# Altium schematic sheet ChargerIC.SchDoc
size A4; SheetNumber: 2; SheetTotal: 4
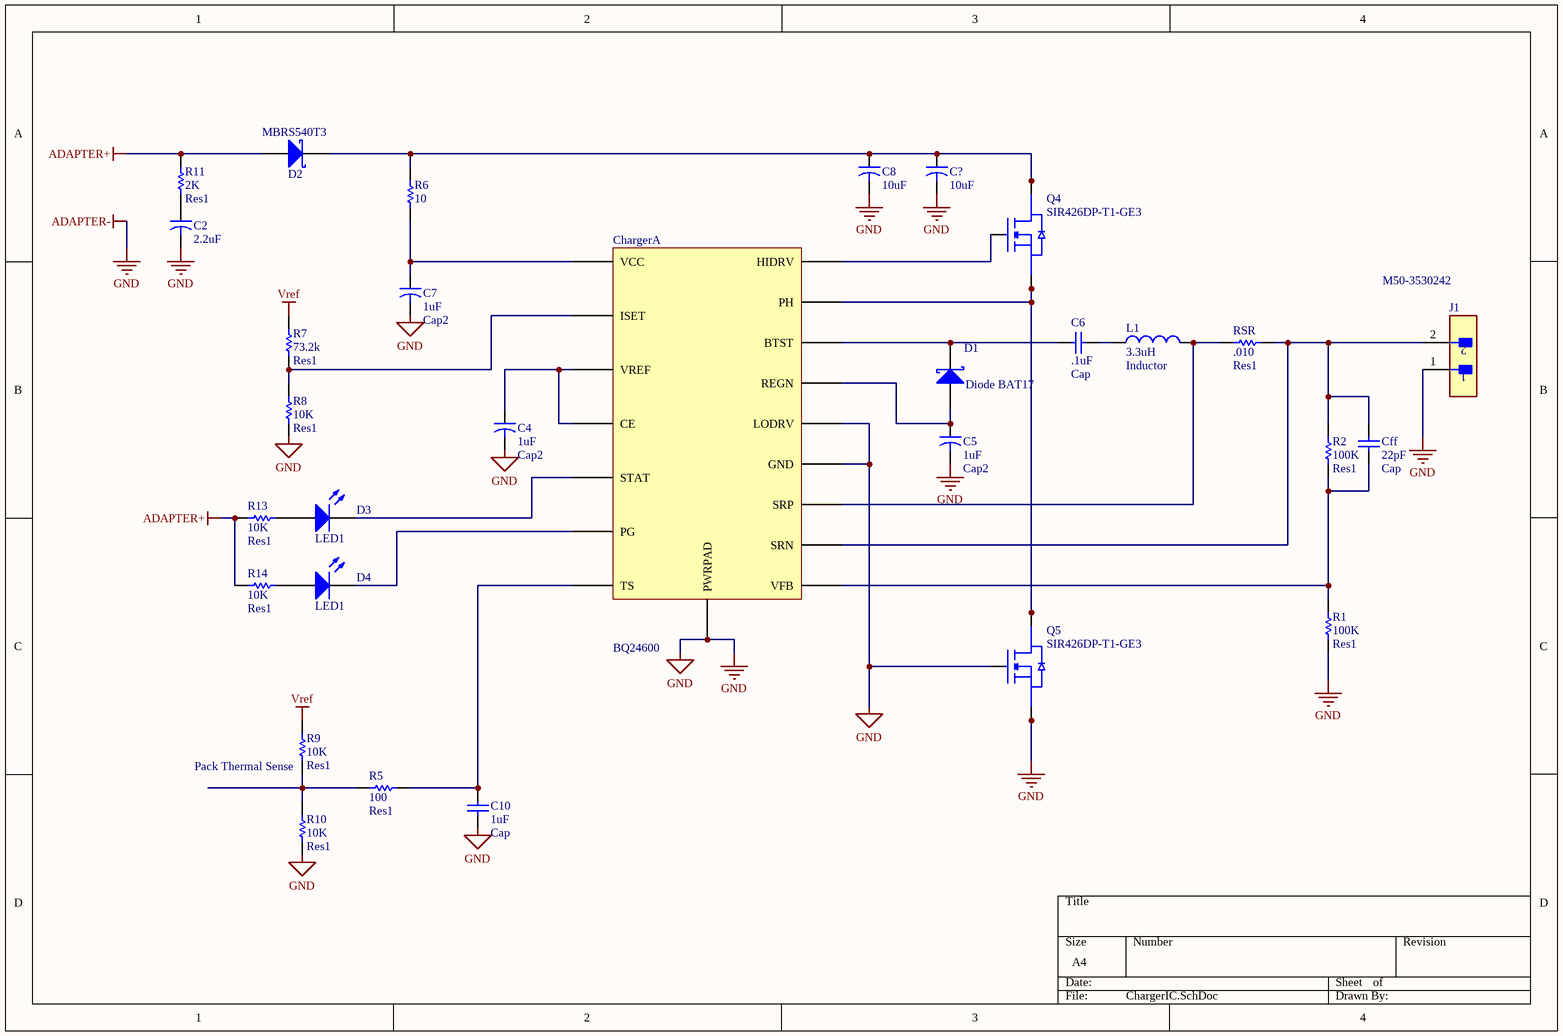
[diagram p0: ChargerIC.SchDoc]

## Parts
C2  value 2.2uF  [CAPR5-4X5]  (hidden comment: Cap2)
C4  Cap2  value 1uF  [CAPR5-4X5]
C5  Cap2  value 1uF  [CAPR5-4X5]
C6  Cap  value .1uF  [RAD-0.3]
C7  Cap2  value 1uF  [CAPR5-4X5]
C8  value 10uF  [CAPR5-4X5]  (hidden comment: Cap2)
C10  Cap  value 1uF  [RAD-0.3]
C?  value 10uF  [CAPR5-4X5]  (hidden comment: Cap2)
Cff  Cap  value 22pF  [RAD-0.3]
Charger  BQ24600  (part A of 2)
D1  Diode BAT17  [SOT-23_N]
D3  LED1  [LED-1]
D4  LED1  [LED-1]
J1  M50-3530242  [FP-M50-3530242-MFG]
L1  Inductor  L1: 3.3uH  [0402-A]
MBRS540T3  D2  [SMB]
Q4  SIR426DP-T1-GE3  [TRANS_SIRA90DP-T1-GE3]
Q5  SIR426DP-T1-GE3  [TRANS_SIRA90DP-T1-GE3]
R1  Res1  value 100K  [AXIAL-0.3]
R2  Res1  value 100K  [AXIAL-0.3]
R5  Res1  value 100  [AXIAL-0.3]
R6  value 10  [AXIAL-0.3]  (hidden comment: 10Ohm)
R7  Res1  value 73.2k  [AXIAL-0.3]
R8  Res1  value 10K  [AXIAL-0.3]
R9  Res1  value 10K  [AXIAL-0.3]
R10  Res1  value 10K  [AXIAL-0.3]
R11  Res1  value 2K  [AXIAL-0.3]
R13  Res1  value 10K  [AXIAL-0.3]
R14  Res1  value 10K  [AXIAL-0.3]
RSR  Res1  value .010  [AXIAL-0.3]

## Nets
ADAPTER+: MBRS540T3.1(A) R11.1 R13.1 R14.1
ADAPTER-: C2.2 C4.2 C5.2 C7.2 C8.2 C10.1 C?.2 Charger.31(LODRV) Charger.32(GND) Charger.36(PWRPAD) J1.1 Q5.1(S) Q5.2(S) Q5.3(S) Q5.4(G) R1.1 R8.1 R10.2  [also labelled GND]
Vref: R7.2 R9.1
NetC2_1: C2.1 R11.2
NetC4_1: C4.1 Charger.17(VREF) Charger.18(CE)
NetC5_1: C5.1 Charger.30(REGN) D1.1(A)
NetC6_1: C6.1 Charger.28(BTST) D1.3(K)
NetC6_2: C6.2 L1.1
NetC7_1: C7.1 Charger.15(VCC) R6.2
NetC8_1: C8.1 C?.1 MBRS540T3.2(K) Q4.5(D) Q4.6(D) Q4.7(D) Q4.8(D) Q4.9(D) R6.1
NetC10_2: C10.2 Charger.29(TS) R5.2
NetCff_1: Cff.1 Charger.35(VFB) R1.2 R2.1
NetCff_2: Cff.2 Charger.34(SRN) J1.2 R2.2 RSR.2
NetCharger_16: Charger.16(ISET) R7.1 R8.2
NetCharger_19: Charger.19(STAT) D3.2(K)
NetCharger_20: Charger.20(PG) D4.2(K)
NetCharger_26: Charger.26(HIDRV) Q4.4(G)
NetCharger_27: Charger.27(PH) Q4.1(S) Q4.2(S) Q4.3(S) Q5.5(D) Q5.6(D) Q5.7(D) Q5.8(D) Q5.9(D)
NetCharger_33: Charger.33(SRP) L1.2 RSR.1
NetD3_1: D3.1(A) R13.2
NetD4_1: D4.1(A) R14.2
NetR5_1: R5.1 R9.2 R10.1

## Notes on the sheet
- (near R9) Pack Thermal Sense

## Library data of the parts
C2 C4 C5 C7 C8 C? = Cap2: Capacitor; Published: 23-Sep-2002; PackageReference: CAPR5-4X5; Publisher: Altium Limited; PackageDescription: Capacitor; 2 Leads
C6 C10 Cff = Cap: Capacitor; Published: 8-Jun-2000; LatestRevisionDate: 17-Jul-2002; LatestRevisionNote: Re-released for DXP Platform.; PackageReference: RAD-0.3; Publisher: Altium Limited; PackageDescription: Radial Cap, Thru-Hole; 2 Leads; 0.3 in Pin Spacing
D1 = Diode BAT17: Silicon RF Schottky Diode for Mixer Applications in the VHF/UHF Range; Note: Pin 2 is not connected and not drawn.; Published: 21-Mar-2003; LatestRevisionDate: 29-May-2009; LatestRevisionNote: IPC-7351 Footprint Added.; DatasheetVersion: Oct-1999; PackageVersion: Sep-2001; PackageReference: SOT-23; Publisher: Altium Limited; PackageDescription: 3-Pin SOT-23 Package 0.95 mm Pitch, 2.5 mm Lead Span; ComponentLink1Description: Manufacturer Link; ComponentLink1URL: http://www.infineon.com/; ComponentLink2Description: Datasheet; ComponentLink2URL: http://www.infineon.com/upload/Document/cmc_upload/documents/009/363/bat17series.pdf
D3 D4 = LED1: Typical RED GaAs LED; Published: 8-Jun-2000; LatestRevisionDate: 08-Jul-2005; LatestRevisionNote: Mech Layer 1 removed.; PackageReference: LED-1; Publisher: Altium Limited; PackageDescription: LED; 2 Leads
J1 = CMP-15831-000040-1: CONN HEADER VERT 2POS 1.27MM
L1 = Inductor: Code_IEC: 1005; Published: 8-Jun-2000; LatestRevisionDate: 29-May-2009; LatestRevisionNote: IPC-7351 Footprint Added.; PackageReference: 0402-A; Publisher: Altium Limited; PackageDescription: Chip Inductor; Code_JEITA: 0402
MBRS540T3 = D Schottky: Schottky Diode; Published: 8-Jun-2000; LatestRevisionDate: 17-Jul-2002; LatestRevisionNote: Re-released for DXP Platform.; PackageReference: SMB; Publisher: Altium Limited; PackageDescription: DO-214-AA/SMB; 2 C-Bend Leads; Body 5.3 x 3.6 mm, inc. leads (LxW); Code_JEDEC: DO-214-AA
Q4 Q5 = SIR426DP-T1-GE3: 40V 30A 41.7W 10.5mohm @ 10V | Siliconix / Vishay SIR426DP-T1-GE3; MF: Vishay Siliconix; SnapEDA_Link: https://www.snapeda.com/parts/SIR426DP-T1-GE3/Vishay/view-part/?ref=snap; Package: PowerPAK SO-8 Vishay; Value: *; MP: SIR426DP-T1-GE3; Check_prices: https://www.snapeda.com/parts/SIR426DP-T1-GE3/Vishay/view-part/?ref=eda
R1 R2 R5-R11 R13 R14 RSR = Res1: Resistor; Published: 8-Jun-2000; LatestRevisionDate: 17-Jul-2002; LatestRevisionNote: Re-released for DXP Platform.; PackageReference: AXIAL-0.3; Publisher: Altium Limited; PackageDescription: Axial Device, Thru-Hole; 2 Leads; 0.3 in Pin Spacing